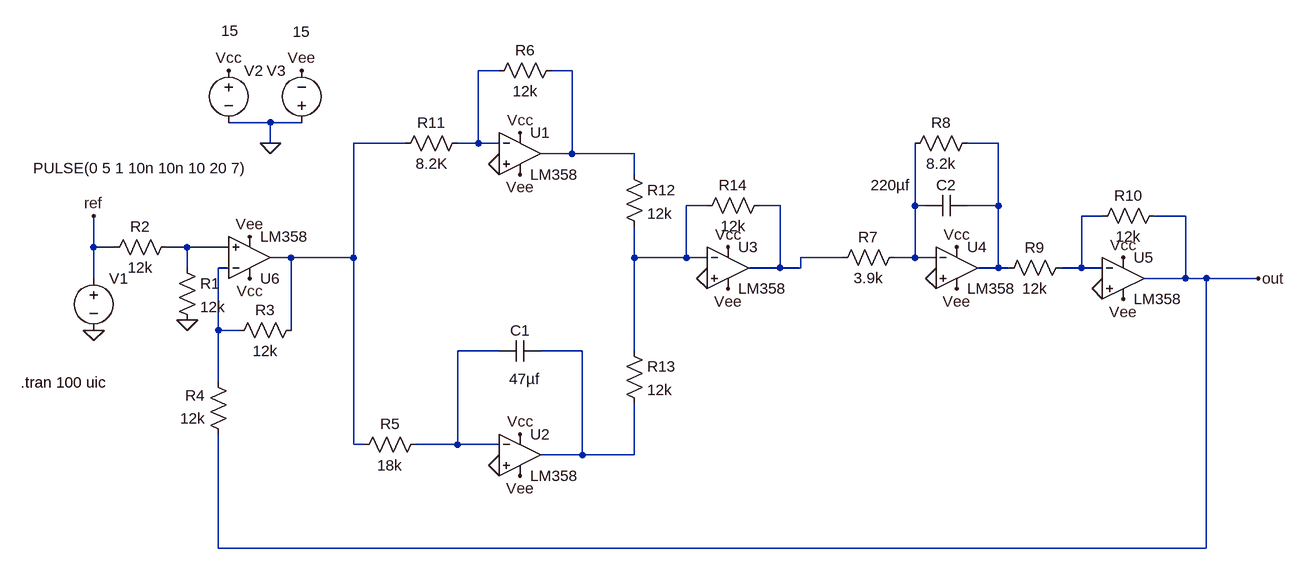
[diagram p0: schematic Controlador Final.asc]
Controlador Final.asc, the LTspice schematic file:
Version 4
SHEET 1 1000 680
WIRE -224 -176 -256 -176
WIRE -112 -176 -144 -176
WIRE -576 -96 -640 -96
WIRE -528 -96 -576 -96
WIRE -576 -64 -576 -96
WIRE -368 -64 -448 -64
WIRE -256 -64 -256 -176
WIRE -256 -64 -288 -64
WIRE -224 -64 -256 -64
WIRE 544 -64 496 -64
WIRE -112 -48 -112 -176
WIRE -112 -48 -160 -48
WIRE -16 -48 -112 -48
WIRE -16 -16 -16 -48
WIRE 96 32 64 32
WIRE 208 32 176 32
WIRE 416 32 416 -64
WIRE 432 32 416 32
WIRE 544 32 544 -64
WIRE 544 32 496 32
WIRE 704 48 672 48
WIRE 832 48 784 48
WIRE -848 96 -848 48
WIRE -816 96 -848 96
WIRE -704 96 -736 96
WIRE -640 96 -704 96
WIRE -544 112 -576 112
WIRE -448 112 -448 -64
WIRE -448 112 -544 112
WIRE -16 112 -16 64
WIRE 64 112 64 32
WIRE 64 112 -16 112
WIRE 96 112 64 112
WIRE 304 112 240 112
WIRE 416 112 416 32
WIRE 416 112 384 112
WIRE 448 112 416 112
WIRE -704 128 -704 96
WIRE -640 128 -656 128
WIRE 208 128 208 32
WIRE 208 128 160 128
WIRE 240 128 240 112
WIRE 240 128 208 128
WIRE 544 128 544 32
WIRE 544 128 512 128
WIRE 560 128 544 128
WIRE 672 128 672 48
WIRE 672 128 640 128
WIRE 704 128 672 128
WIRE -848 144 -848 96
WIRE 832 144 832 48
WIRE 832 144 768 144
WIRE 864 144 832 144
WIRE 944 144 864 144
WIRE -656 224 -656 128
WIRE -624 224 -656 224
WIRE -544 224 -544 112
WIRE -224 256 -288 256
WIRE -96 256 -160 256
WIRE -16 256 -16 112
WIRE -656 304 -656 224
WIRE -448 400 -448 112
WIRE -432 400 -448 400
WIRE -288 400 -288 256
WIRE -288 400 -352 400
WIRE -224 400 -288 400
WIRE -96 416 -96 256
WIRE -96 416 -160 416
WIRE -16 416 -16 336
WIRE -16 416 -96 416
WIRE -656 560 -656 384
WIRE 864 560 864 144
WIRE 864 560 -656 560
FLAG -848 224 0
FLAG -704 208 0
FLAG -224 432 0
FLAG -224 -32 0
FLAG 448 144 0
FLAG 704 160 0
FLAG -848 48 ref
FLAG 944 144 out
FLAG -192 384 Vcc
FLAG -192 -80 Vcc
FLAG 480 96 Vcc
FLAG 736 112 Vcc
FLAG -608 144 Vcc
FLAG -640 -176 Vcc
FLAG -528 -176 Vee
FLAG -608 80 Vee
FLAG -192 448 Vee
FLAG -192 -16 Vee
FLAG 480 160 Vee
FLAG 736 176 Vee
FLAG -576 -64 0
FLAG 96 144 0
FLAG 128 160 Vee
FLAG 128 96 Vcc
SYMBOL voltage -848 128 R0
WINDOW 3 -93 -154 Left 2
WINDOW 123 0 0 Left 0
WINDOW 39 0 0 Left 0
SYMATTR Value PULSE(0 5 1 10n 10n 10 20 7)
SYMATTR InstName V1
SYMBOL res -720 112 R0
SYMATTR InstName R1
SYMATTR Value 12k
SYMBOL cap -160 240 R90
WINDOW 0 0 32 VBottom 2
WINDOW 3 43 25 VTop 2
SYMATTR InstName C1
SYMATTR Value 47µf
SYMBOL res -720 80 R90
WINDOW 0 0 56 VBottom 2
WINDOW 3 32 56 VTop 2
SYMATTR InstName R2
SYMATTR Value 12k
SYMBOL res -528 208 R90
WINDOW 0 0 56 VBottom 2
WINDOW 3 32 56 VTop 2
SYMATTR InstName R3
SYMATTR Value 12k
SYMBOL res -640 400 R180
WINDOW 0 36 76 Left 2
WINDOW 3 36 40 Left 2
SYMATTR InstName R4
SYMATTR Value 12k
SYMBOL res -336 384 R90
WINDOW 0 0 56 VBottom 2
WINDOW 3 32 56 VTop 2
SYMATTR InstName R5
SYMATTR Value 18k
SYMBOL res -128 -192 R90
WINDOW 0 0 56 VBottom 2
WINDOW 3 32 56 VTop 2
SYMATTR InstName R6
SYMATTR Value 12k
SYMBOL res 400 96 R90
WINDOW 0 0 56 VBottom 2
WINDOW 3 32 56 VTop 2
SYMATTR InstName R7
SYMATTR Value 3.9k
SYMBOL cap 496 16 R90
WINDOW 0 0 32 VBottom 2
WINDOW 3 -31 118 VTop 2
SYMATTR InstName C2
SYMATTR Value 220µf
SYMBOL res 512 -80 R90
WINDOW 0 0 56 VBottom 2
WINDOW 3 32 56 VTop 2
SYMATTR InstName R8
SYMATTR Value 8.2k
SYMBOL res 656 112 R90
WINDOW 0 0 56 VBottom 2
WINDOW 3 32 56 VTop 2
SYMATTR InstName R9
SYMATTR Value 12k
SYMBOL res 800 32 R90
WINDOW 0 0 56 VBottom 2
WINDOW 3 32 56 VTop 2
SYMATTR InstName R10
SYMATTR Value 12k
SYMBOL voltage -640 -192 R0
WINDOW 123 0 0 Left 0
WINDOW 39 0 0 Left 0
WINDOW 3 -12 -45 Left 2
SYMATTR Value 15
SYMATTR InstName V2
SYMBOL voltage -528 -80 R180
WINDOW 0 24 96 Left 2
WINDOW 3 -13 156 Left 2
WINDOW 123 0 0 Left 0
WINDOW 39 0 0 Left 0
SYMATTR InstName V3
SYMATTR Value 15
SYMBOL res -272 -80 R90
WINDOW 0 0 56 VBottom 2
WINDOW 3 32 56 VTop 2
SYMATTR InstName R11
SYMATTR Value 8.2K
SYMBOL res -32 -32 R0
SYMATTR InstName R12
SYMATTR Value 12k
SYMBOL res -32 240 R0
SYMATTR InstName R13
SYMATTR Value 12k
SYMBOL res 192 16 R90
WINDOW 0 0 56 VBottom 2
WINDOW 3 32 56 VTop 2
SYMATTR InstName R14
SYMATTR Value 12k
SYMBOL Opamps\\LM358 -192 -112 R0
SYMATTR InstName U1
SYMBOL Opamps\\LM358 -192 352 R0
SYMATTR InstName U2
SYMBOL Opamps\\LM358 128 64 R0
SYMATTR InstName U3
SYMBOL Opamps\\LM358 480 64 R0
SYMATTR InstName U4
SYMBOL Opamps\\LM358 736 80 R0
SYMATTR InstName U5
SYMBOL Opamps\\LM358 -608 176 M180
SYMATTR InstName U6
TEXT -960 304 Left 2 !.tran 100 uic

The netlist it stands for:
* Controlador Final.asc
V1 ref 0 PULSE(0 5 1 10n 10n 10 20 7)
R1 N009 0 12k
C1 N012 N011 47µf
R2 N009 ref 12k
R3 N003 N010 12k
R4 out N010 12k
R5 N011 N003 18k
R6 N002 N001 12k
R7 N007 N006 3.9k
C2 N004 N007 220µf
R8 N004 N007 8.2k
R9 N008 N004 12k
R10 out N008 12k
V2 Vcc 0 15
V3 0 Vee 15
R11 N001 N003 8.2K
R12 N002 N005 12k
R13 N005 N012 12k
R14 N006 N005 12k
XU1 0 N001 Vcc Vee N002 LM358  ; pins In+ In- V+ V- OUT
XU2 0 N011 Vcc Vee N012 LM358  ; pins In+ In- V+ V- OUT
XU3 0 N005 Vcc Vee N006 LM358  ; pins In+ In- V+ V- OUT
XU4 0 N007 Vcc Vee N004 LM358  ; pins In+ In- V+ V- OUT
XU5 0 N008 Vcc Vee out LM358  ; pins In+ In- V+ V- OUT
XU6 N009 N010 Vcc Vee N003 LM358  ; pins In+ In- V+ V- OUT
.tran 100 uic
.backanno
.end

* Results of the author's LTspice run, read from the files saved beside the schematic
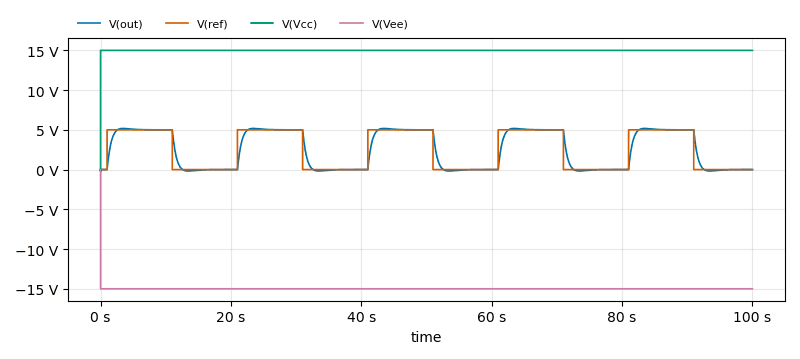
[diagram p1: Transient Analysis of Controlador Final.asc, plotted from the saved traces]
* Transient Analysis, 1 run:
*   V(out): min -255.6 mV, max 5.176 V, average 2.5 V, rms 3.489 V, last 48.53 µV
*   V(ref): min 0 V, max 5 V, average 2.5 V, rms 3.536 V, last 0 V
*   V(Vcc): min 0 V, max 15 V, average 15 V, rms 15 V, last 15 V
*   V(Vee): min -15 V, max 0 V, average -15 V, rms 15 V, last -15 V